# EAGLE design miditransformer (EAGLE 6.4)
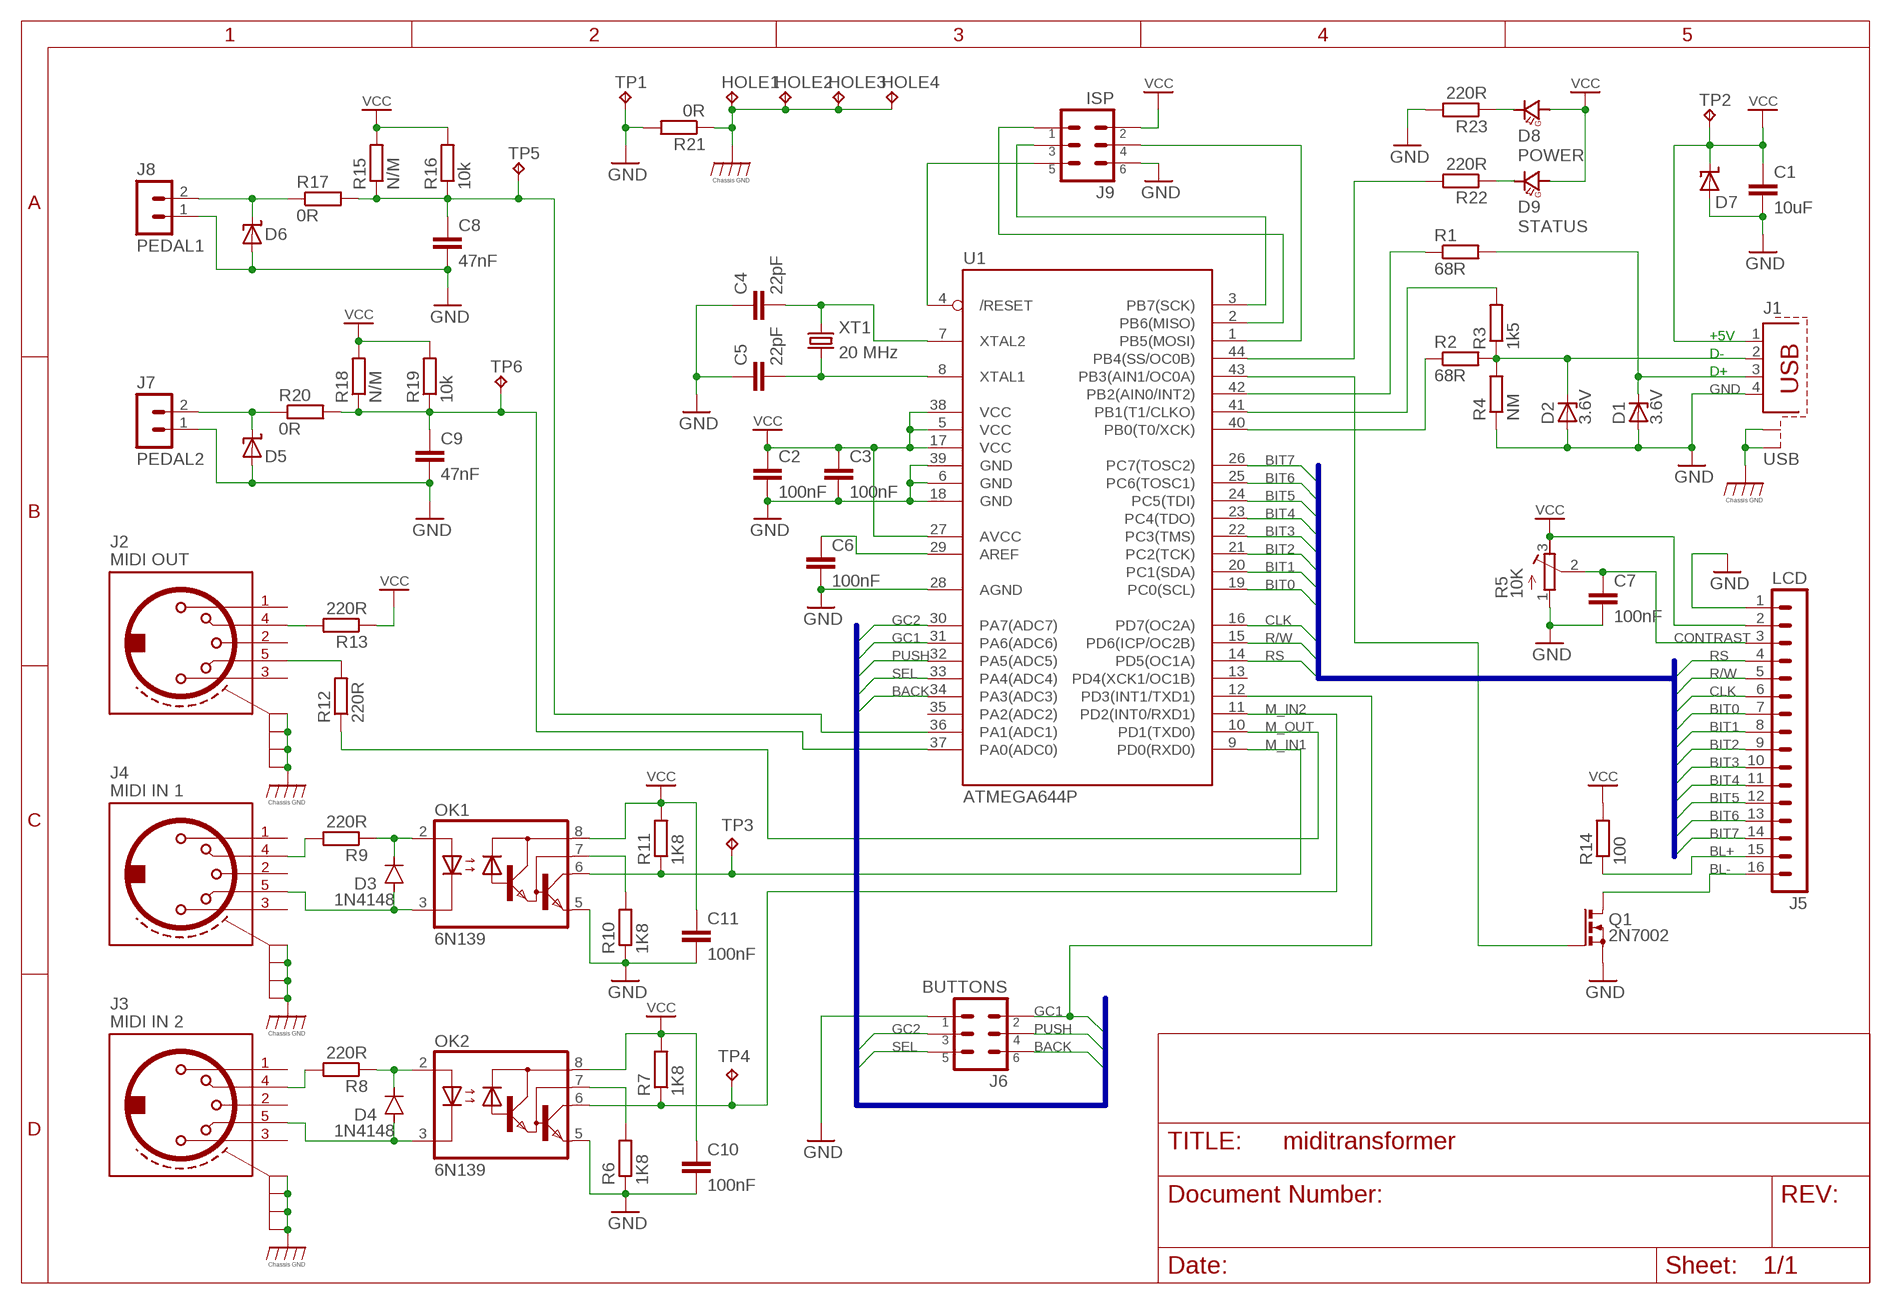
[diagram p0: schematic, sheet 1]

## Parts
C1  10uF  C-EU_1210R  [C1210]
C2  100nF  C-EU_0805R  [C0805]
C3  100nF  C-EU_0805R  [C0805]
C4  22pF  C-EU_0805R  [C0805]
C5  22pF  C-EU_0805R  [C0805]
C6  100nF  C-EU_0805R  [C0805]
C7  100nF  C-EU_0805R  [C0805]
C8  47nF  C-EU_0805R  [C0805]
C9  47nF  C-EU_0805R  [C0805]
C10  100nF  C-EU_0805R  [C0805]
C11  100nF  C-EU_0805R  [C0805]
D1  3.6V  ZENER-DIODEDO34-7  [DO34Z7]
D2  3.6V  ZENER-DIODEDO34-7  [DO34Z7]
D3  1N4148  1N4148MINIMELF  [MINIMELF]
D4  1N4148  1N4148MINIMELF  [MINIMELF]
D5  SUPPRESSOR-SMB  [SMB]
D6  SUPPRESSOR-SMB  [SMB]
D7  SUPPRESSOR-SMB  [SMB]
D8  POWER  LTL-1CHG  [LED3MM]
D9  STATUS  LTL-1CHG  [LED3MM]
HOLE1  HOLE_PAD  [HOLE_PAD_3.2]
HOLE2  HOLE_PAD  [HOLE_PAD_3.2]
HOLE3  HOLE_PAD  [HOLE_PAD_3.2]
HOLE4  HOLE_PAD  [HOLE_PAD_3.2]
J1  USB  PN61729-S  [PN61729-S]
J2  MIDI OUT  DIN5_FEMALE_PCB  [DIN5_FEM_UNIV]
J3  MIDI IN 2  DIN5_FEMALE_PCB  [DIN5_FEM_UNIV]
J4  MIDI IN 1  DIN5_FEMALE_PCB  [DIN5_FEM_UNIV]
J5  LCD  HEADER2X8LS  [HDR_S_2X8]
J6  BUTTONS  HEADER2X3S  [HDR_S_2X3]
J7  PEDAL2  HEADER1X2KK  [MOLEX_KK_HDR2_FL]
J8  PEDAL1  HEADER1X2KK  [MOLEX_KK_HDR2_FL]
J9  ISP  HEADER2X3  [HDR_2X3]
OK1  6N139  6N138DIL08  [DIL08]
OK2  6N139  6N138DIL08  [DIL08]
Q1  2N7002  [SOT23]
R1  68R  R-EU0805  [R0805]
R2  68R  R-EU0805  [R0805]
R3  1k5  R-EU0805  [R0805]
R4  NM  R-EU0805  [R0805]
R5  10K  R-TRIMM  [RTRIM3339P]
R6  1K8  R-EU0805  [R0805]
R7  1K8  R-EU0805  [R0805]
R8  220R  R-EU0805  [R0805]
R9  220R  R-EU0805  [R0805]
R10  1K8  R-EU0805  [R0805]
R11  1K8  R-EU0805  [R0805]
R12  220R  R-EU0805  [R0805]
R13  220R  R-EU0805  [R0805]
R14  100  R-EULEADED-7.5  [0207/7]
R15  N/M  R-EU0805  [R0805]
R16  10k  R-EU0805  [R0805]
R17  0R  R-EU0805  [R0805]
R18  N/M  R-EU0805  [R0805]
R19  10k  R-EU0805  [R0805]
R20  0R  R-EU0805  [R0805]
R21  0R  R-EU0805  [R0805]
R22  220R  R-EU0805  [R0805]
R23  220R  R-EU0805  [R0805]
TP1  TPTH-15-06  [TP-TH-15-06]
TP2  TPTH-15-06  [TP-TH-15-06]
TP3  TPTH-15-06  [TP-TH-15-06]
TP4  TPTH-15-06  [TP-TH-15-06]
TP5  TPTH-15-06  [TP-TH-15-06]
TP6  TPTH-15-06  [TP-TH-15-06]
U1  ATMEGA644P  [TQFP44]
XT1  20 MHz  XTAL_HC49  [HC49]

## Nets
BACK: J6.6 U1.34(PA3(ADC3))
BIT0: J5.7 U1.19(PC0(SCL))
BIT1: J5.8 U1.20(PC1(SDA))
BIT2: J5.9 U1.21(PC2(TCK))
BIT3: J5.10 U1.22(PC3(TMS))
BIT4: J5.11 U1.23(PC4(TDO))
BIT5: J5.12 U1.24(PC5(TDI))
BIT6: J5.13 U1.25(PC6(TOSC1))
BIT7: J5.14 U1.26(PC7(TOSC2))
BL+: J5.15 R14.1
BL-: J5.16 Q1.3(D)
CLK: J5.6 U1.16(PD7(OC2A))
CONTRAST: C7.1 J5.3 R5.2(S)
GC1: J6.2 U1.12(PD3(INT1/TXD1)) U1.31(PA6(ADC6))
GC2: J6.3 U1.30(PA7(ADC7))
GND: C1.2 C2.2 C3.2 C4.1 C5.1 C6.2 C7.2 C8.2 C9.2 C10.2 C11.2 D1.A D2.A D5.A D6.A D7.A J1.4 J5.1 J6.1 J7.1 J8.1 J9.6 OK1.5(GND) OK2.5(GND) Q1.2(S) R4.1 R5.1(E) R6.1 R10.1 R21.2 R23.2 TP1.1(TP) U1.6(GND) U1.18(GND) U1.28(AGND) U1.39(GND)
M_IN1: OK1.6(VO) R11.1 TP3.1(TP) U1.9(PD0(RXD0))
M_IN2: OK2.6(VO) R7.1 TP4.1(TP) U1.11(PD2(INT0/RXD1))
M_OUT: R12.1 U1.10(PD1(TXD0))
N$1: D1.C J1.3 R1.2
N$2: D2.C J1.2 R2.2 R3.1 R4.2
N$3: R1.1 U1.42(PB2(AIN0/INT2))
N$4: R2.1 U1.40(PB0(T0/XCK))
N$5: C5.2 U1.8(XTAL1) XT1.2
N$6: R3.2 U1.41(PB1(T1/CLKO))
N$7: C4.2 U1.7(XTAL2) XT1.1
N$8: D9.C R22.1
N$9: OK2.7(VB) R6.2
N$11: J9.5 U1.4(/RESET)
N$12: J9.1 U1.2(PB6(MISO))
N$13: J9.3 U1.3(PB7(SCK))
N$14: J9.4 U1.1(PB5(MOSI))
N$15: D3.A J4.5 OK1.3(C)
N$16: D4.C OK2.2(A) R8.1
N$17: D8.C R23.1
N$18: J3.4 R8.2
N$19: D4.A J3.5 OK2.3(C)
N$20: OK1.7(VB) R10.2
N$21: R22.2 U1.44(PB4(SS/OC0B))
N$22: Q1.1(G) U1.43(PB3(AIN1/OC0A))
N$23: D3.C OK1.2(A) R9.1
N$24: D6.C J8.2 R17.1
N$25: J4.4 R9.2
N$26: J2.4 R13.2
N$27: J2.5 R12.2
N$28: D5.C J7.2 R20.1
N$29: C6.1 U1.29(AREF)
N$33: C9.1 R18.1 R19.1 R20.2 TP6.1(TP) U1.37(PA0(ADC0))
N$34: C8.1 R15.1 R16.1 R17.2 TP5.1(TP) U1.36(PA1(ADC1))
P$1: HOLE1.P$0(TP) HOLE2.P$0(TP) HOLE3.P$0(TP) HOLE4.P$0(TP) J1.S1 J1.S2 J2.PE@1(PE) J2.PE@2(PE) J2.PE@3(PE) J2.PE@4(PE) J3.PE@1(PE) J3.PE@2(PE) J3.PE@3(PE) J3.PE@4(PE) J4.PE@1(PE) J4.PE@2(PE) J4.PE@3(PE) J4.PE@4(PE) R21.1 ; supply symbol labelled CGND
PUSH: J6.4 U1.32(PA5(ADC5))
R/W: J5.5 U1.15(PD6(ICP/OC2B))
RS: J5.4 U1.14(PD5(OC1A))
SEL: J6.5 U1.33(PA4(ADC4))
VCC: C1.1 C2.1 C3.1 C10.1 C11.1 D7.C D8.A D9.A J1.1 J5.2 J9.2 OK1.8(VCC) OK2.8(VCC) R5.3(A) R7.2 R11.2 R13.1 R14.2 R15.2 R16.2 R18.2 R19.2 TP2.1(TP) U1.5(VCC) U1.17(VCC) U1.27(AVCC) U1.38(VCC)
Unconnected: J2.1 J2.2 J2.3 J3.1 J3.2 J3.3 J4.1 J4.2 J4.3 U1.13(PD4(XCK1/OC1B)) U1.35(PA2(ADC2))

## Buses
BIT[0..7],RS,R/W,CLK
GC1,GC2,PUSH,SEL,BACK

## Notes on the sheet
- +5V
- D-
- D+

## Library data of the parts
C1 = cap:C-EU_: Capacitor non-polarized (EU symbol); CATEGORY: CAPACITOR_CERAMIC; FOOTPRINT: 1210
C2-C11 = cap:C-EU_: Capacitor non-polarized (EU symbol); CATEGORY: CAPACITOR_CERAMIC; FOOTPRINT: 0805
D1 D2 = _newbylars:ZENER-DIODE: Z-Diode
D3 D4 = _newbylars:1N4148: DIODE high speed (Philips)
D5-D7 = _newbylars:SUPPRESSOR-: Suppressor diode
D8 D9 = leds:LTL-1CHG: 3mm (T-1) Green LED Mfg: Lite-On Inc Green, diffused, 12.6mcd@2.1V; CATEGORY: DIODE; FOOTPRINT: LED3MM2PIN
HOLE1-HOLE4 = _newbylars:HOLE_PAD
J1 = _newbylars:PN61729-S: BERG USB connector; OC_FARNELL: unknown; OC_NEWARK: unknown
J2-J4 = _newbylars:DIN5_FEMALE_PCB: PCB Mount Female CONNECTOR DIN 5 pins 90 deg. with shield, horizontal (DIN 41524)
J5 = con-head:HEADER2X8L: 16 pin (2x8) header One-row schematics symbol
J6 = con-head:HEADER2X3: 6 pin (2x3) header Two-row schematics symbol
J7 J8 = con-head:HEADER1X2: 2 pin SIL header 100mil / 2.54mm pin-spacing. Author: Mikkel Holm Olsen <eagle@symlink.dk>
J9 = _newbylars:HEADER2X3: 6 pin (2x3) header Two-row schematics symbol
OK1 OK2 = _newbylars:6N138: 6N138 OPTOCOUPLER
Q1 = fet:2N700?: N-channel Enhancement Mode Field Effect Transistor 2N7002 by Fairchild Semiconductor simple schematics symbol Author: Mikkel Holm Olsen <eagle@symlink.dk>
R1-R4 R6-R23 = _newbylars:R-EU: Resistor european symbol RESISTOR
R5 = _newbylars:R-TRIMM: TRIMM RESISTOR
TP1-TP6 = _newbylars:TP: Test pad
U1 = avr-mcu:ATMEGA644P: Microcontroller 64kB Flash, 4kB SRAM, 2kB EEPROM
XT1 = crystal:XTAL_: Crystal

## Board
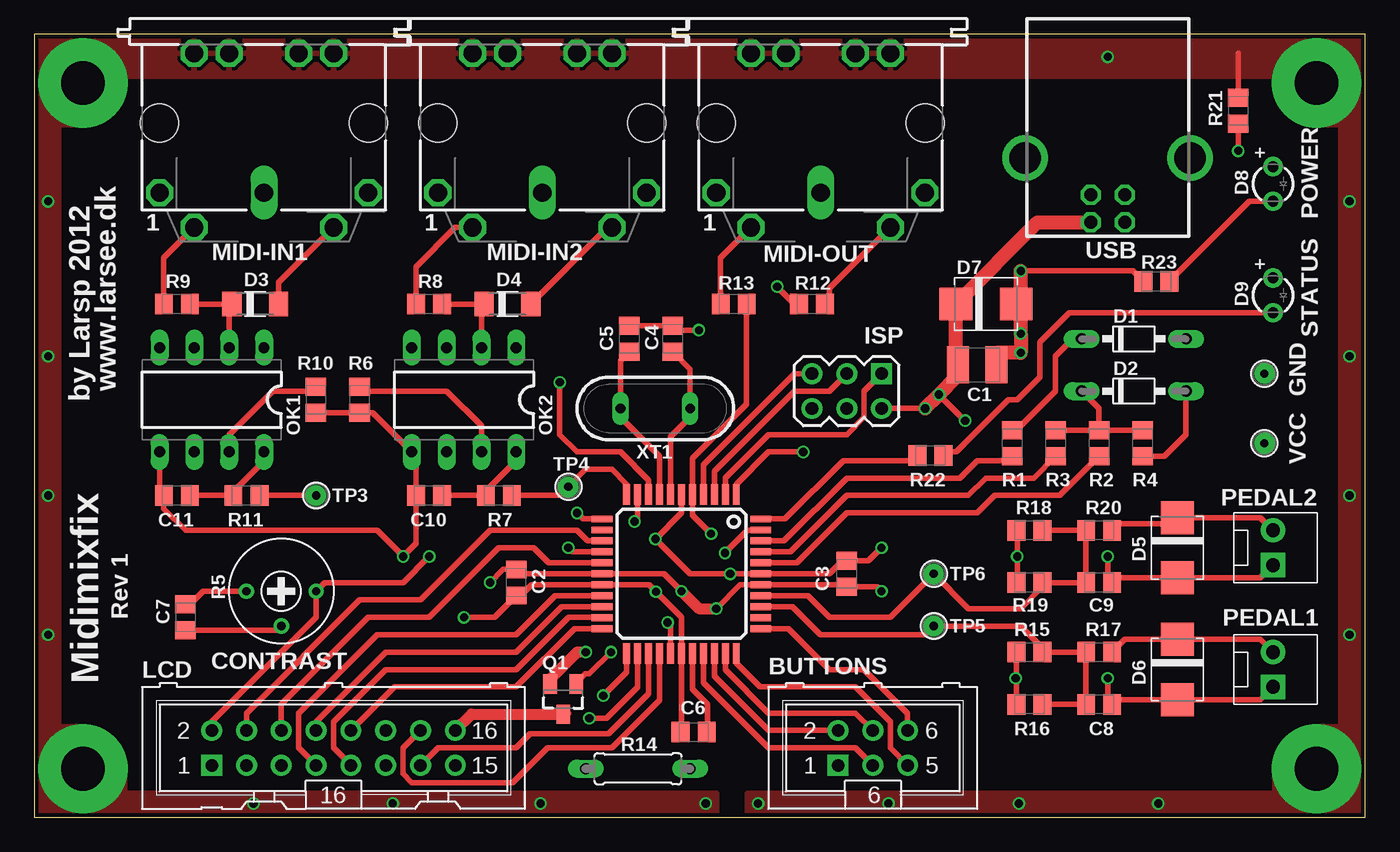
[diagram p1: board, top side]
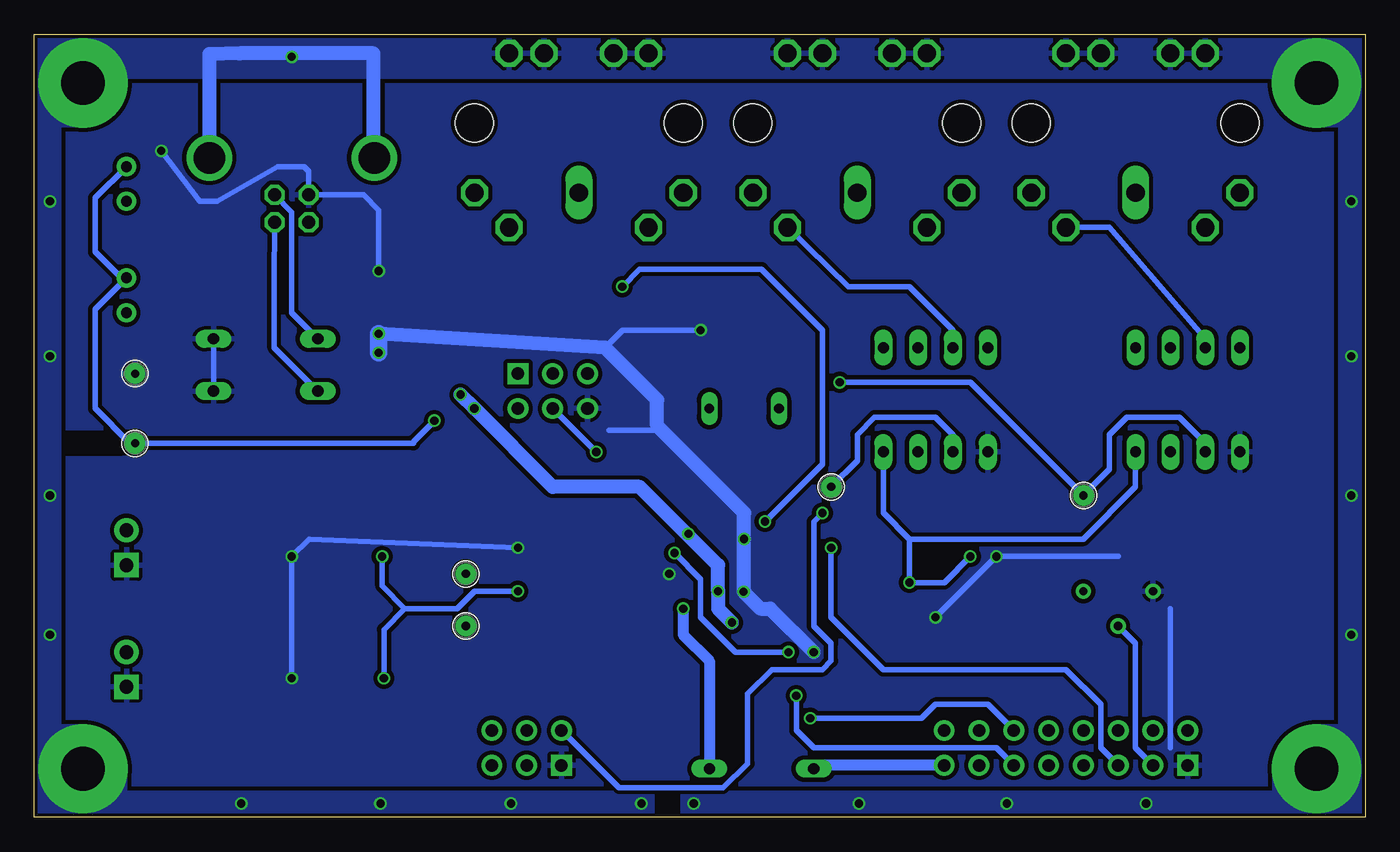
[diagram p2: board, bottom side, seen from below]

Size 97.16 x 57.15 mm. Coordinates in mm from the lower left corner, seen from the top.
Outline: 0,0 97.16,0 97.16,57.15 0,57.15 0,0
Copper layers (1*16): Top 0.035mm / dielectric 1.5mm / Bottom 0.035mm
Design rules "Fusion_eagle_rule_v1.1": minimum track width 6mil, minimum drill 12mil, track to track 6mil, track to pad 6mil, pad to pad 6mil, via to via 6mil, smd to smd 0mil, copper to edge 10mil, drill to drill 10mil, minimum pad ring 10mil, minimum via ring 6mil, stop-mask expansion 2mil, vias tented up to drill 100mil, thermal gap 10mil
bRestrict: area 90.8,26.7 to 94.6,27.9

### Footprints (pad centres in the part's own frame; a part is rotated, then mirrored left to right if it is on the bottom)
C1210 = smd 1.6 x 2.7: 1 -1.4,0; 2 1.4,0
C0805 = smd 1.3 x 1.5: 1 -0.95,0; 2 0.95,0
DO34Z7 = drill 0.813 long: A 3.81,0; C -3.81,0
MINIMELF = smd 1.4 x 1.8: A 1.7,0; C -1.7,0
SMB = smd 2.4 x 2.4: A 2.2,0; C -2.2,0
LED3MM = drill 0.8 pad 1.4: A -1.27,0; C 1.27,0
HOLE_PAD_3.2 = drill 3.2 pad 6.5: P$0 0,0
PN61729-S = drill 0.95 octagon: 1 1.25,4.71; 2 -1.25,4.71; 3 -1.25,2.71; 4 1.25,2.71 | drill 2.3 pad 2.9: S1 -6.02,0; S2 6.02,0
DIN5_FEM_UNIV = drill 1.321 octagon: 1 7.62,5.08; 3 -7.62,5.08; 4 5.08,7.62; 5 -5.08,7.62; PE@1 5.08,-5.08; PE@2 2.54,-5.08; PE@3 -2.54,-5.08; PE@4 -5.08,-5.08 | drill 1.321 long: 2 0,5.08 | hole 2.794: 7.62,0; -7.62,0
HDR_S_2X8 = drill 0.914 pad 1.524 square: 1 -8.89,-1.27 | drill 0.914 pad 1.524: 2 -8.89,1.27; 3 -6.35,-1.27; 4 -6.35,1.27; 5 -3.81,-1.27; 6 -3.81,1.27; 7 -1.27,-1.27; 8 -1.27,1.27; 9 1.27,-1.27; 10 1.27,1.27; 11 3.81,-1.27; 12 3.81,1.27; 13 6.35,-1.27; 14 6.35,1.27; 15 8.89,-1.27; 16 8.89,1.27
HDR_S_2X3 = drill 0.914 pad 1.524 square: 1 -2.54,-1.27 | drill 0.914 pad 1.524: 2 -2.54,1.27; 3 0,-1.27; 4 0,1.27; 5 2.54,-1.27; 6 2.54,1.27
MOLEX_KK_HDR2_FL = drill 1.016 pad 1.778 square: 1 0,0 | drill 1.016 pad 1.778: 2 2.54,0
HDR_2X3 = drill 0.914 pad 1.524 square: 1 0,0 | drill 0.914 pad 1.524: 2 0,2.54; 3 2.54,0; 4 2.54,2.54; 5 5.08,0; 6 5.08,2.54
DIL08 = drill 0.8 long: 1 -3.81,-3.81; 2 -1.27,-3.81; 3 1.27,-3.81; 4 3.81,-3.81; 5 3.81,3.81; 6 1.27,3.81; 7 -1.27,3.81; 8 -3.81,3.81
SOT23 = smd 1 x 1.4: 1 -0.95,-1.1; 2 0.95,-1.1; 3 0,1.1
R0805 = smd 1.3 x 1.5: 1 -0.95,0; 2 0.95,0
RTRIM3339P = drill 0.61: 1 -2.54,0; 2 0,-2.54; 3 2.54,0
0207/7 = drill 0.813 long: 1 -3.81,0; 2 3.81,0
TP-TH-15-06 = drill 0.6 pad 1.5: 1 0,0
TQFP44 = smd 1.5 x 0.5: 1 -5.8,4; 2 -5.8,3.2; 3 -5.8,2.4; 4 -5.8,1.6; 5 -5.8,0.8; 6 -5.8,0; 7 -5.8,-0.8; 8 -5.8,-1.6; 9 -5.8,-2.4; 10 -5.8,-3.2; 11 -5.8,-4; 23 5.8,-4; 24 5.8,-3.2; 25 5.8,-2.4; 26 5.8,-1.6; 27 5.8,-0.8; 28 5.8,0; 29 5.8,0.8; 30 5.8,1.6; 31 5.8,2.4; 32 5.8,3.2; 33 5.8,4 | smd 0.5 x 1.5: 12 -4,-5.8; 13 -3.2,-5.8; 14 -2.4,-5.8; 15 -1.6,-5.8; 16 -0.8,-5.8; 17 0,-5.8; 18 0.8,-5.8; 19 1.6,-5.8; 20 2.4,-5.8; 21 3.2,-5.8; 22 4,-5.8; 34 4,5.8; 35 3.2,5.8; 36 2.4,5.8; 37 1.6,5.8; 38 0.8,5.8; 39 0,5.8; 40 -0.8,5.8; 41 -1.6,5.8; 42 -2.4,5.8; 43 -3.2,5.8; 44 -4,5.8
HC49 = drill 0.711 long: 1 -2.54,0; 2 2.54,0

### Placement (x,y rotation side)
C1  68.83,33.02 0 top
C2  35.18,17.14 270 top
C3  59.31,17.78 90 top
C4  46.61,34.92 270 top
C5  43.43,34.92 270 top
C6  48.13,6.22 180 top
C7  11.05,14.61 90 top
C8  77.72,8.26 0 top
C9  77.72,17.14 0 top
C10  28.83,23.5 180 top
C11  10.41,23.5 180 top
D1  80.26,34.92 0 top
D2  80.26,31.11 0 top
D3  16.13,37.47 0 top
D4  34.54,37.47 0 top
D5  83.44,19.68 270 top
D6  83.44,10.79 270 top
D7  69.47,37.47 0 top
D8  90.42,46.23 270 top
D9  90.42,38.1 270 top
HOLE1  3.56,53.59 0 top
HOLE2  3.56,3.56 0 top
HOLE3  93.6,53.59 0 top
HOLE4  93.6,3.56 0 top
J1  78.36,48.13 180 top
J2  57.4,50.67 180 top
J3  37.08,50.67 180 top
J4  16.76,50.67 180 top
J5  21.84,5.08 0 top
J6  61.21,5.08 0 top
J7  90.42,18.41 90 top
J8  90.42,9.53 90 top
J9  61.85,32.38 180 top
OK1  12.95,30.48 180 top
OK2  31.37,30.48 180 top
Q1  38.61,8.64 180 top
R1  71.37,27.3 90 top
R2  77.72,27.3 90 top
R3  74.55,27.3 270 top
R4  80.9,27.3 90 top
R5  18.03,16.51 0 top
R6  23.75,30.48 90 top
R7  33.91,23.5 180 top
R8  28.83,37.47 180 top
R9  10.41,37.47 180 top
R10  20.57,30.48 90 top
R11  15.49,23.5 180 top
R12  56.77,37.47 0 top
R13  51.05,37.47 180 top
R14  44.07,3.56 0 top
R15  72.64,12.06 180 top
R16  72.64,8.26 180 top
R17  77.72,12.06 180 top
R18  72.64,20.95 180 top
R19  72.64,17.14 180 top
R20  77.72,20.95 180 top
R21  87.88,51.56 270 top
R22  65.41,26.42 180 top
R23  81.92,39.12 180 top
TP1  89.79,32.38 0 top
TP2  89.79,27.3 0 top
TP3  20.57,23.5 0 top
TP4  38.99,24.13 0 top
TP5  65.66,13.97 0 top
TP6  65.66,17.78 0 top
U1  47.24,17.78 270 top
XT1  45.34,29.84 180 top

### Tracks (layer width: path | path; a pad name or v marks a point on that pad's centre or on a via)
BACK
  Top 0.406: J6.6 63.75,7.62 60.58,10.79 58.04,10.79 55.05,13.78 U1.34
BIT0
  Top 0.406: U1.19 38.02,16.18 35.18,13.34 25.02,13.34 19.3,7.62 19.3,5.08 J5.7
BIT1
  Top 0.406: U1.20 38.49,15.38 35.18,12.06 25.65,12.06 20.57,6.99 J5.8
BIT2
  Top 0.406: J5.9 21.84,5.08 21.84,6.99 25.65,10.79 35.18,10.79 38.99,14.61 41.42,14.61 U1.21
BIT3
  Top 0.406: U1.22 39.43,13.78 35.18,9.53 26.29,9.53 J5.10
BIT4  (via drill 0.6)
  Top 0.406: U1.23 43.24,10.61 v41.53,8.89
  Bottom 0.406: J5.11 26.92,5.08 40.26,5.08 41.53,6.35 v41.53,8.89
BIT5  (via drill 0.6)
  Top 0.406: U1.24 44.04,9.5 41.78,7.24 v40.51,7.24
  Bottom 0.406: J5.12 27.56,8.26 31.37,8.26 32.38,7.24 v40.51,7.24
BIT6
  Top 0.406: J5.13 29.46,5.08 35.18,5.08 36.2,6.1 41.91,6.1 44.84,9.03 U1.25
BIT7
  Top 0.406: U1.26 45.64,8.56 42.16,5.08 37.47,5.08 34.92,2.54 27.56,2.54 26.92,3.17 26.92,5.08 J5.14
BL+
  Bottom 0.813: J5.15 40.01,3.81 R14.1
BL-
  Top 0.406: Q1.3 38.99,7.62
  Top 0.813: J5.16 31.92,7.54 Q1.3
CLK
  Top 0.406: U1.16 37.55,18.58 36.45,19.68 33.91,19.68 28.83,14.61 24.38,14.61 18.03,8.26 J5.6
CONTRAST
  Top 0.406: C7.1 17.72,13.65 R5.2
  Bottom 0.406: J5.3 16.76,5.08 16.76,12.7 R5.2
GC1  (via drill 0.6)
  Top 0.406: J6.2 53.59,6.35 49.64,10.3 U1.31 | U1.12 40.07,21.78 v39.62,22.23
  Bottom 0.406: v39.62,22.23 40.26,21.59 40.26,13.97 38.99,12.7 38.99,11.43 39.62,10.79 43.31,10.79 45.09,9.02 45.09,3.94 46.86,2.16 54.48,2.16 J6.2
GC2
  Top 0.406: U1.30 48.84,9.83 53.59,5.08 59.94,5.08 J6.3
GND  (via drill 0.6)
  Top 0.406: 37.66,10.1 Q1.2 | 47.24,5.71 47.24,6.16 C6.2 47.24,6.92 U1.28 47.24,14.61 v45.38,16.47 44.87,16.98 U1.18 36.28,16.98 35.5,16.2 C2.2 33.59,14.61 v31.37,14.61 | OK1.5 9.14,23.82 C11.2 9.46,22.54 11.05,20.95 25.02,20.95 v26.92,19.05 27.88,20 C10.2 27.88,26.35 OK2.5 24.7,29.53 R6.1 R10.1 | C5.1 C4.1 46.92,35.56 v48.51,35.56 | v61.85,19.68 60.89,18.73 C3.2 58.99,18.41 58.67,18.41 58.04,17.78 U1.39 v50.8,17.78 47.88,17.78 v45.34,20.32 47.24,22.23 U1.6 | 72.01,38.1 72.3,38.1 D7.A | R4.1 82.49,26.36 84.07,27.94 D2.A | C7.2 11.36,15.55 12.32,16.51 R5.1 | J7.1 89.49,17.48 D5.A | 82.8,17.48 79.01,17.48 C9.2 78.36,17.46 v78.36,19.05 | 82.8,17.48 D5.A | J8.1 89.49,8.6 D6.A | D6.A 82.8,8.6 82.8,8.89 | D5.A 83.1,17.48 | 82.8,17.48 82.8,17.78 | v78.36,10.16 78.36,8.26 C8.2 79.01,8.6 D6.A | v87.88,48.64 R21.2 | R23.2 80.2,39.88 v72.01,39.88 | 70.23,33.91 C1.2
  Top 0.813: 72.01,37.12 D7.A 72.01,37.47 72.01,38.1 | C1.2 70.23,33.15 | v40.26,12.06 39.62,12.06 37.66,10.1
  Top 1.016: 72.01,37.12 v72.01,35.31 v72.01,33.91 70.23,33.91 | 72.01,37.34 v72.01,39.88
  Bottom 0.406: 14.22,5.08 14.22,15.24 | 18.03,19.05 v26.92,19.05 v31.37,14.61 | D2.A D1.A | 51.37,28.26 55.18,28.26 | v61.85,19.68 77.09,20.32 v78.36,19.05 v78.36,10.16 | v48.51,35.56 54.23,35.56 55.5,34.29 | v72.01,39.88 72.01,44.32 73.11,45.42 J1.4 77.11,47.14 77.47,47.5 79.38,47.5 83.82,44.96 85.09,44.96 v87.88,48.64
  Bottom 0.813: v45.38,16.47 45.34,16.51
  Bottom 1.016: v72.01,35.31 55.5,34.29 51.69,30.48 51.69,28.57 51.37,28.26 45.34,22.23 v45.34,20.32 45.34,16.51 | v40.26,12.06 43.43,15.24 44.15,15.24 v45.38,16.47
  Bottom 1.27: v72.01,35.31 v72.01,33.91
  pour Bottom (isolate 0.305, rank 2): 96.01,1.27 1.27,1.27 1.27,55.12 95.89,55.12
M_IN1  (via drill 0.6)
  Top 0.406: TP3.1 R11.1 | U1.9 44.84,24.62 42.8,26.67 39.62,26.67 38.35,27.94 v38.35,31.75
  Bottom 0.406: OK1.6 11.68,27.3 13.59,29.21 17.4,29.21 18.67,27.94 18.67,25.4 TP3.1 28.83,31.75 v38.35,31.75
M_IN2
  Top 0.406: U1.11 43.24,24.32 42.16,25.4 40.26,25.4 TP4.1 38.35,23.5 R7.1
  Bottom 0.406: OK2.6 30.1,27.94 31.37,29.21 35.81,29.21 37.08,27.94 37.08,26.04 TP4.1
M_OUT  (via drill 0.6)
  Top 0.406: v43.81,21.59 44.04,21.87 U1.10 | R12.1 55.5,37.47 v54.23,38.73
  Bottom 0.406: v43.81,21.59 39.62,25.78 39.62,35.56 44.07,40.01 52.96,40.01 v54.23,38.73
N$1
  Top 0.406: D1.C 75.82,34.92 74.55,33.66 74.55,31.11 71.37,27.94 R1.2
  Bottom 0.406: D1.C 78.36,36.83 78.36,44.17 J1.3
N$2
  Top 0.406: R2.2 R4.2 | R3.1 R2.2 | R2.2 77.72,29.84 D2.C
  Bottom 0.406: D2.C 79.63,34.29 79.63,39.12 J1.2
N$3
  Top 0.406: U1.42 54.72,20.18 59.31,24.77 67.56,24.77 68.83,26.04 71.05,26.04 R1.1
N$4
  Top 0.406: U1.40 55.66,18.58 59.31,22.23 68.83,22.23 70.1,23.5 74.86,23.5 R2.1
N$5
  Top 0.406: U1.8 45.64,26.36 42.8,29.21 XT1.2 42.8,33.34 C5.2
N$6
  Top 0.406: U1.41 55.19,19.38 59.31,23.5 68.2,23.5 69.47,24.77 72.96,24.77 R3.2
N$7
  Top 0.406: U1.7 46.44,27.77 47.88,29.21 XT1.1 47.88,32.7 C4.2
N$8
  Top 0.406: D9.C 75.56,36.83 73.41,34.67 73.41,32.13 71.75,30.48 71.12,30.48 67.31,26.67 66.61,26.67 R22.1
N$9
  Top 0.406: OK2.7 32.64,28.57 30.1,31.11 24.06,31.11 R6.2
N$11
  Top 0.406: U1.4 48.84,25.73 55.5,32.38 J9.5
N$12
  Top 0.406: J9.1 60.58,31.11 60.58,29.21 59.31,27.94 53.59,27.94 50.44,24.79 U1.2
N$13
  Top 0.406: J9.3 58.04,31.11 55.5,31.11 49.64,25.26 U1.3
N$14  (via drill 0.6)
  Top 0.406: U1.1 51.24,24.32 53.59,26.67 v56.13,26.67
  Bottom 0.406: v56.13,26.67 J9.4
N$15
  Top 0.406: 17.83,37.9 D3.A 17.83,39.04 J4.5
  Bottom 0.406: OK1.3 11.68,34.92 18.67,43.05 J4.5
N$16
  Top 0.406: R8.1 D4.C 32.64,37.26 OK2.2
N$17
  Top 0.406: R23.1 88.71,44.96 D8.C
N$18
  Top 0.406: R8.2 27.88,40.2 30.73,43.05 J3.4
N$19
  Top 0.406: D4.A 41.83,43.05 J3.5
  Bottom 0.406: J3.5 37.72,38.73 33.27,38.73 30.1,35.56 OK2.3
N$20
  Top 0.406: OK1.7 14.22,27.94 17.4,31.11 20.26,31.11 R10.2
N$21
  Top 0.406: U1.44 54.8,21.78 59.05,26.04 64.07,26.04 R22.2
N$22  (via drill 0.6)
  Top 0.406: Q1.1 40.19,10.47 40.51,10.47 v42.1,12.06 | U1.43 53.02,20.95 52.07,20.95 v50.42,19.3
  Bottom 0.406: v42.1,12.06 45.97,12.06 48.51,14.61 48.51,17.4 v50.42,19.3
N$23
  Top 0.406: R9.1 D3.C 14.22,37.26 OK1.2
N$24
  Top 0.406: J8.2 89.49,12.99 D6.C 79.6,12.99 R17.1
N$25
  Top 0.406: R9.2 9.46,40.83 J4.4
N$26
  Top 0.406: R13.2 50.1,40.83 J2.4
N$27
  Top 0.406: R12.2 58.04,37.47 58.04,38.61 J2.5
N$28
  Top 0.406: J7.2 89.49,21.89 D5.C 82.97,21.42 | 82.97,21.42 82.51,20.95 | R20.1 79.14,21.42 82.97,21.42
N$29
  Top 0.406: U1.29 48.04,9.36 49.15,8.26 49.15,6.92 C6.1
N$33
  Top 0.406: U1.37 56.46,16.18 58.04,14.61 62.48,14.61 TP6.1 68.2,15.24 72.01,15.24 73.59,16.82 R19.1 C9.1 R20.2 R18.1
N$34
  Top 0.406: U1.36 55.36,15.38 57.4,13.34 65.02,13.34 TP5.1 72.01,13.97 73.59,12.38 R15.1 R17.2 C8.1 R16.1
P$1  (via drill 0.6)
  Top 0.406: R21.1 87.88,55.75
  Bottom 1.016: J1.S2 72.39,48.46 72.39,55.75 82.17,55.75 84.38,55.7 J1.S1
  other vias: 1.02,44.96 1.02,33.66 1.02,23.5 1.02,13.34 71.88,1.02 82.04,1.02 16,1.02 26.16,1.02 36.96,1.02 49.02,1.02 52.83,1.02 62.36,1.02 96.01,13.34 96.01,23.5 96.01,33.66 96.01,44.96 78.36,55.5
  pour Top (isolate 0.305): 0.25,0.25 49.78,0.25 49.78,1.78 6.6,1.78 6.6,3.3 3.3,3.3 3.3,6.6 1.78,6.6 1.78,50.55 3.43,50.55 3.43,53.72 6.6,53.72 6.6,54.1 90.55,54.1 90.55,53.72 93.85,53.72 93.85,50.55 95.38,50.55 95.38,6.6 93.73,6.6 93.73,3.3 90.55,3.3 90.55,1.78 52.07,1.78 52.07,0.25 96.9,0.25 96.9,56.9 0.25,56.9
  pour Bottom (isolate 0.254): 0.25,0.25 49.78,0.25 49.78,1.78 6.6,1.78 6.6,3.56 3.3,3.56 3.3,6.6 1.78,6.6 1.78,50.55 3.43,50.55 3.94,53.21 6.6,53.72 6.6,54.1 93.85,54.1 93.85,50.55 95.38,50.55 95.38,6.6 93.73,6.6 93.73,3.3 90.55,3.3 90.55,1.78 52.07,1.78 52.07,0.25 96.9,0.25 96.9,56.9 0.25,56.9
PUSH
  Top 0.406: J6.4 59.94,7.62 53.59,7.62 50.44,10.77 U1.32
R/W  (via drill 0.6)
  Top 0.406: U1.15 39.29,19.38 v38.99,19.68
  Bottom 0.406: J5.5 19.3,5.08 19.3,8.26 21.84,10.79 35.18,10.79 38.99,14.61 v38.99,19.68
RS
  Top 0.406: U1.14 40.4,20.18 39.62,20.95 33.27,20.95 28.19,15.88 23.75,15.88 15.49,7.62 J5.4
SEL
  Top 0.406: J6.5 62.48,5.08 62.48,6.99 59.94,9.53 52.96,9.53 51.24,11.24 U1.33
VCC  (via drill 0.6)
  Top 0.406: 67.27,33.19 C1.1 67.43,32.26 | J5.2 12.95,6.99 20.57,14.61 R5.3 21.21,17.14 26.92,17.14 v28.83,19.05 | C11.1 R11.2 14.54,23.82 16.76,26.04 OK1.8 | C2.1 35.49,17.78 | C2.1 35.5,17.78 U1.17 45.97,17.78 v47.24,16.51 | OK2.8 35.18,26.04 32.96,23.82 R7.2 C10.1 | U1.27 46.44,14.01 v46.23,14.22 | v49.4,20.7 48.04,22.06 U1.5 48.04,26.2 52,30.16 R13.1 | C2.1 34.22,18.09 v33.27,17.14 | v61.85,16.51 61.53,16.83 C3.1 arc90 59.16,16.98 U1.38 51.52,16.98 v49.78,15.24 | R18.2 71.75,20.89 v71.75,19.05 71.75,17.21 R19.2 | R15.2 71.69,10.23 v71.63,10.16 71.69,10.09 R16.2 | v65.02,29.84 J9.2 | v66.04,30.86 v67.94,28.96
  Top 0.813: v49.78,15.24 48.51,15.24 v47.24,16.51
  Top 1.016: J1.1 73.23,43.42 D7.C 67.27,33.19 | 67.43,32.26 v66.04,30.86 v65.02,29.84
  Bottom 0.406: 33.27,20.32 v33.27,17.14 30.73,17.14 v28.83,19.05 | 33.27,20.32 35.18,22.23 OK2.8 | OK1.8 16.76,24.13 20.57,20.32 33.27,20.32 | v61.85,16.51 65.02,16.51 66.29,15.24 70.1,15.24 | 70.1,15.24 71.75,16.89 v71.75,19.05 | 70.1,15.24 71.63,13.72 v71.63,10.16 | D8.A 92.71,45.21 92.71,41.27 90.81,39.37 D9.A 92.71,37.08 92.71,29.84 90.17,27.3 TP2.1 69.47,27.3 69.47,27.43 v67.94,28.96
  Bottom 0.813: 49.47,20.64 v49.4,20.7 | v49.78,15.24 49.78,13.34 47.88,11.43 R14.2
  Bottom 1.016: v46.23,14.22 47.24,15.24 v47.24,16.51 47.24,18.41 49.47,20.64 52.96,24.13 59.31,24.13 v65.02,29.84 v66.04,30.86

### Text on the board
tPlace: + | POWER | MIDI-IN1 | MIDI-IN2 | MIDI-OUT | USB | + | ISP | STATUS | www.larsee.dk | GND | by Larsp 2012 | VCC | PEDAL2 | Rev 1 | PEDAL1 | CONTRAST | Midimixfix | LCD | BUTTONS
tDocu: STATUS | POWER | USB | PEDAL2 | PEDAL1 | LCD | BUTTONS